# EAGLE design hothouse-switching-no-branding (EAGLE 9.6.2)
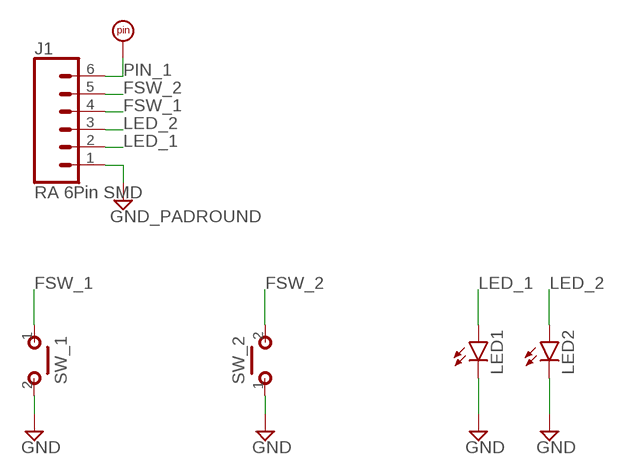
[diagram p0: schematic, sheet 1]

## Parts
GND2  GND_PADROUND  [ROUND]
J1  RA 6Pin SMD  CONN_06SILK_FEMALE_PTH  [1X06]
LED1  LED3MM  [LED3MM]
LED2  LED3MM  [LED3MM]
SW_1  SPST.PBS.MOM  [SPST.PBS.MOM]
SW_2  SPST.PBS.MOM  [SPST.PBS.MOM]
U$5  PADS.RND_NL  [PAD2]

## Nets
FSW_1: J1.4 SW_1.1(P)
FSW_2: J1.5 SW_2.2(S)
GND: GND2.1(GND) J1.1 LED1.K(C) LED2.K(C) SW_1.2(S) SW_2.1(P)
LED_1: J1.2 LED1.A
LED_2: J1.3 LED2.A
PIN_1: J1.6 U$5.P$1

## Library data of the parts
GND2 = hothouse-switching-no-branding:GND_PAD: Ground use this to hook up ground connections throughout a schematic instead of running wire automatically labels the net "GND"
J1 = hothouse-switching-no-branding:CONN_06: Multi connection point. Often used as Generic Header-pin footprint for 0.1 inch spaced/style header connections On any of the 0.1 inch spaced packages, you can populate with these: Break Away Headers - Straight <https://www.sparkfun.com/products/116> (PRT-00116) Break Away Male Headers - Right Angle <https://www.sparkfun.com/products/553> (PRT-00553) Female Headers <https://www.sparkfun.com/products/115> (PRT-00115) Break Away Headers - Machine Pin <https://www.sparkfun.com/products/117> (PRT-00117) Break Away Female Headers - Swiss Machine Pin <https://www.sparkfun.com/products/743> (PRT-00743) Arduino Stackable Header - 6 Pin <https://www.sparkfun.com/products/9280> (PRT-09280) For SCREWTERMINALS and SPRING TERMINALS visit here: Screw Terimnals on SparkFun.com <https://www.sparkfun.com/search/results?term=Screw+Terminals> (5mm/3.5mm/2.54mm spacing) This device is also useful as a general connection point to wire up your design to another part of your project. Our various solder wires solder well into these plated through hole pads. Hook-Up Wire - Assortment (Stranded, 22 AWG) <https://www.sparkfun.com/products/11375> (PRT-11375) Hook-Up Wire - Assortment (Solid Core, 22 AWG) <https://www.sparkfun.com/products/11367> (PRT-11367) View the entire wire category on our website here <https://www.sparkfun.com/categories/141>; PROD_ID: CONN-11293; SF_ID: GPS-00579
LED1 LED2 = hothouse-switching-no-branding:LED
SW_1 SW_2 = hothouse-switching-no-branding:SPST.PBS.MOM: SPST Momentary
U$5 = hothouse-switching-no-branding:PADS.: Pads For I/O connections or test point pads on PCBs.

## Board
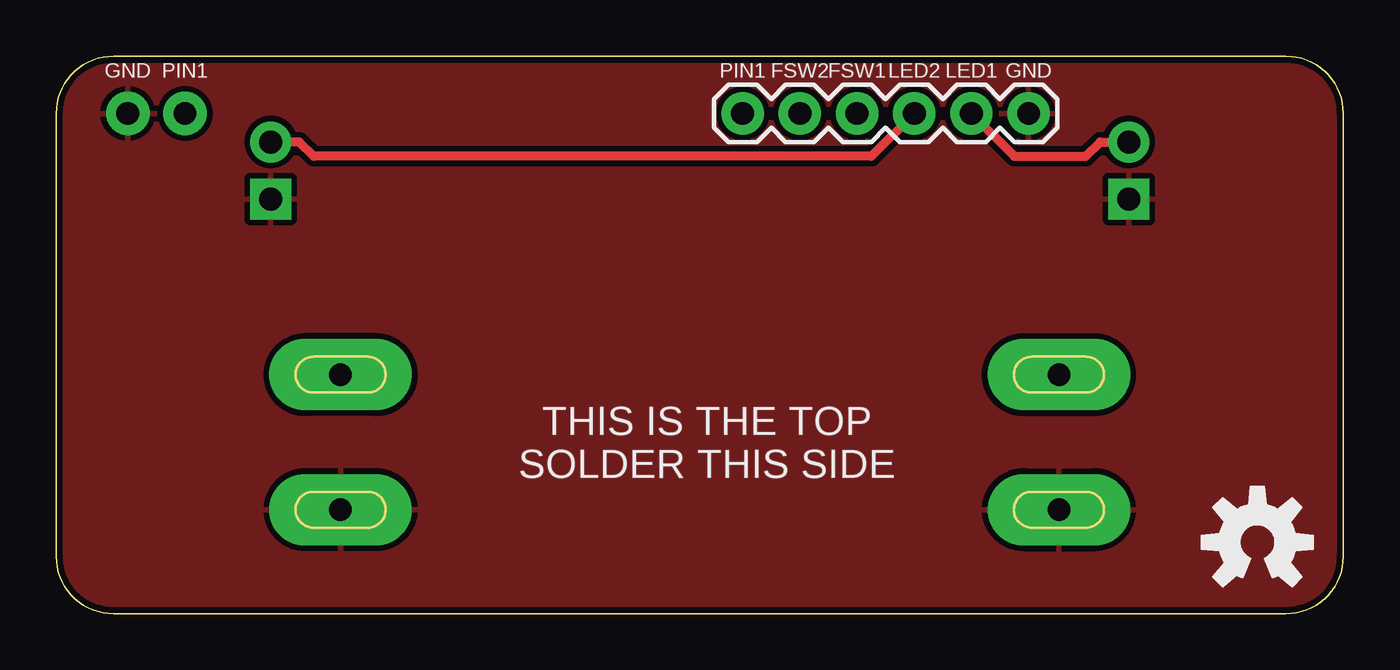
[diagram p1: board, top side]
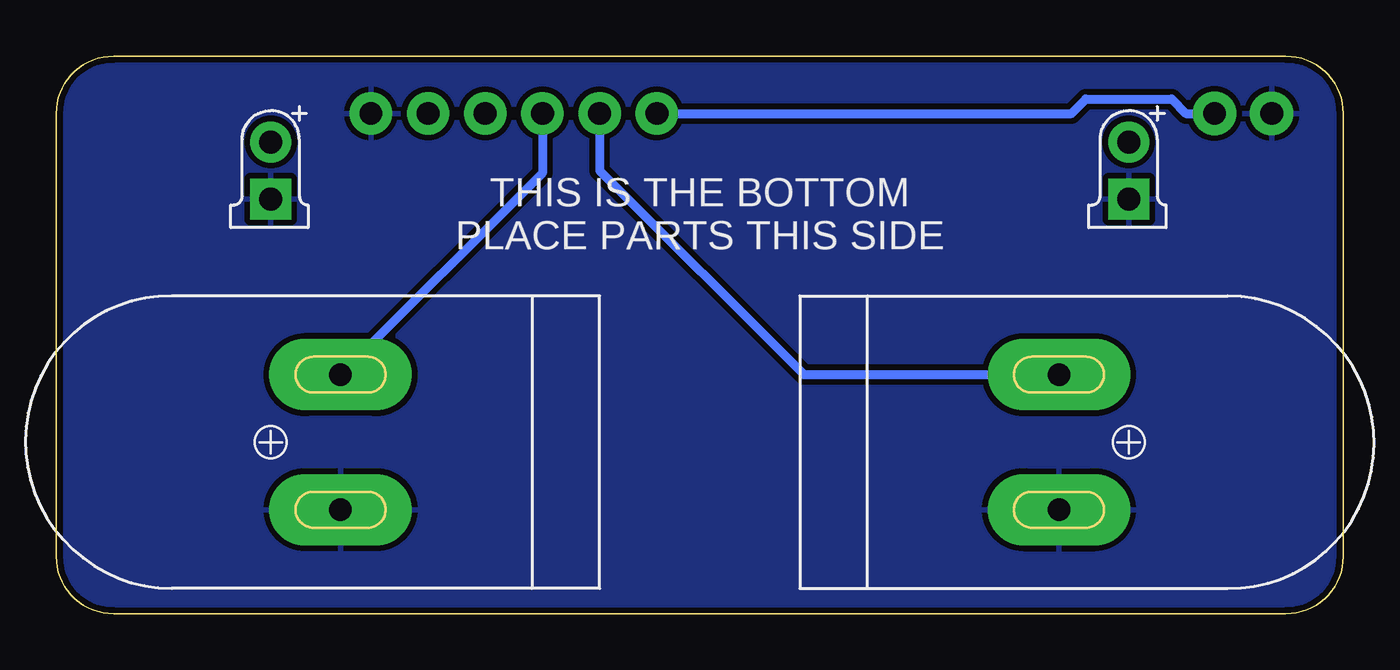
[diagram p2: board, bottom side, seen from below]

Size 57.15 x 24.77 mm. Coordinates in mm from the lower left corner, seen from the top.
Outline: 2.54,0 arc-90 0,2.54 0,22.23 arc-90 2.54,24.77 54.61,24.77 arc-90 57.15,22.23 57.15,2.54 arc-90 54.61,0 2.54,0
Copper layers (1*16): Top 0.035mm / dielectric 1.6mm / Bottom 0.035mm
Design rules "jlcpcb-2layers": minimum track width 5mil, minimum drill 0.3mm, track to track 5mil, track to pad 5mil, pad to pad 5mil, via to via 5mil, smd to smd 5mil, copper to edge 0.2mm, drill to drill 6mil, minimum pad ring 10mil, minimum via ring 3mil, stop-mask expansion 4mil, vias tented up to drill 0mil, thermal gap 10mil

### Footprints (pad centres in the part's own frame; a part is rotated, then mirrored left to right if it is on the bottom)
ROUND = drill 1.016 pad 1.93: 1 0,0
1X06 = drill 1.016 pad 1.88: 1 0,0; 2 2.54,0; 3 5.08,0; 4 7.62,0; 5 10.16,0; 6 12.7,0
LED3MM = drill 1.016 pad 1.778: A -1.27,0 | drill 1.016 pad 1.778 square: K 1.27,0
SPST.PBS.MOM = drill 1 pad 3.175 long: 1 -3.1,3; 2 -3.1,-3
PAD2 = drill 1.016 pad 1.93: P$1 0,0

### Placement (x,y rotation side)
GND2  3.17,22.23 0 top
J1  43.18,22.23 180 top
LED1  47.62,19.68 270 bottom
LED2  9.53,19.68 270 bottom
SW_1  47.62,7.62 0 top
SW_2  9.53,7.62 180 top
U$1  [OSHW-LOGO-M]  53.34,3.17 0 top
U$5  5.71,22.23 0 top

### Tracks (layer width: path | path; a pad name or v marks a point on that pad's centre or on a via)
FSW_1
  Bottom 0.406: J1.4 35.56,19.59 SW_1.1
FSW_2
  Bottom 0.406: J1.5 33.02,19.68 23.95,10.62 SW_2.2
GND
  pour Bottom (isolate 0.254): 0,12.06 0,22.23 arc-90 2.54,24.77 27.94,24.77 54.61,24.77 arc-90 57.15,22.23 57.15,6.35 57.15,2.54 arc-90 54.61,0 8.26,0 2.54,0 arc-90 0,2.54
  pour Top (isolate 0.254): 0,12.06 0,22.23 arc-90 2.54,24.77 26.04,24.77 54.61,24.77 arc-90 57.15,22.23 57.15,7.62 57.15,2.54 arc-90 54.61,0 16.51,0 2.54,0 arc-90 0,2.54
  pour Bottom (isolate 0.254): 0,10.79 0,22.23 arc-90 2.54,24.77 26.67,24.77 54.61,24.77 arc-90 57.15,22.23 57.15,7.62 57.15,2.54 arc-90 54.61,0 13.34,0 2.54,0 arc-90 0,2.54
LED_1
  Top 0.406: J1.2 42.55,20.32 45.72,20.32 46.35,20.95 LED1.A
LED_2
  Top 0.406: J1.3 36.2,20.32 11.43,20.32 10.79,20.95 LED2.A
PIN_1
  Bottom 0.406: J1.6 12.06,22.23 11.43,22.86 7.62,22.86 6.99,22.23 U$5.P$1

### Text on the board
tPlace: GND | PIN1 | PIN1 | FSW2 | FSW1 | LED2 | LED1 | GND | THIS IS THE TOP / SOLDER THIS SIDE
bPlace: THIS IS THE BOTTOM / PLACE PARTS THIS SIDE